# EAGLE design RHD2000_cable_adapt2 (EAGLE 6.2)
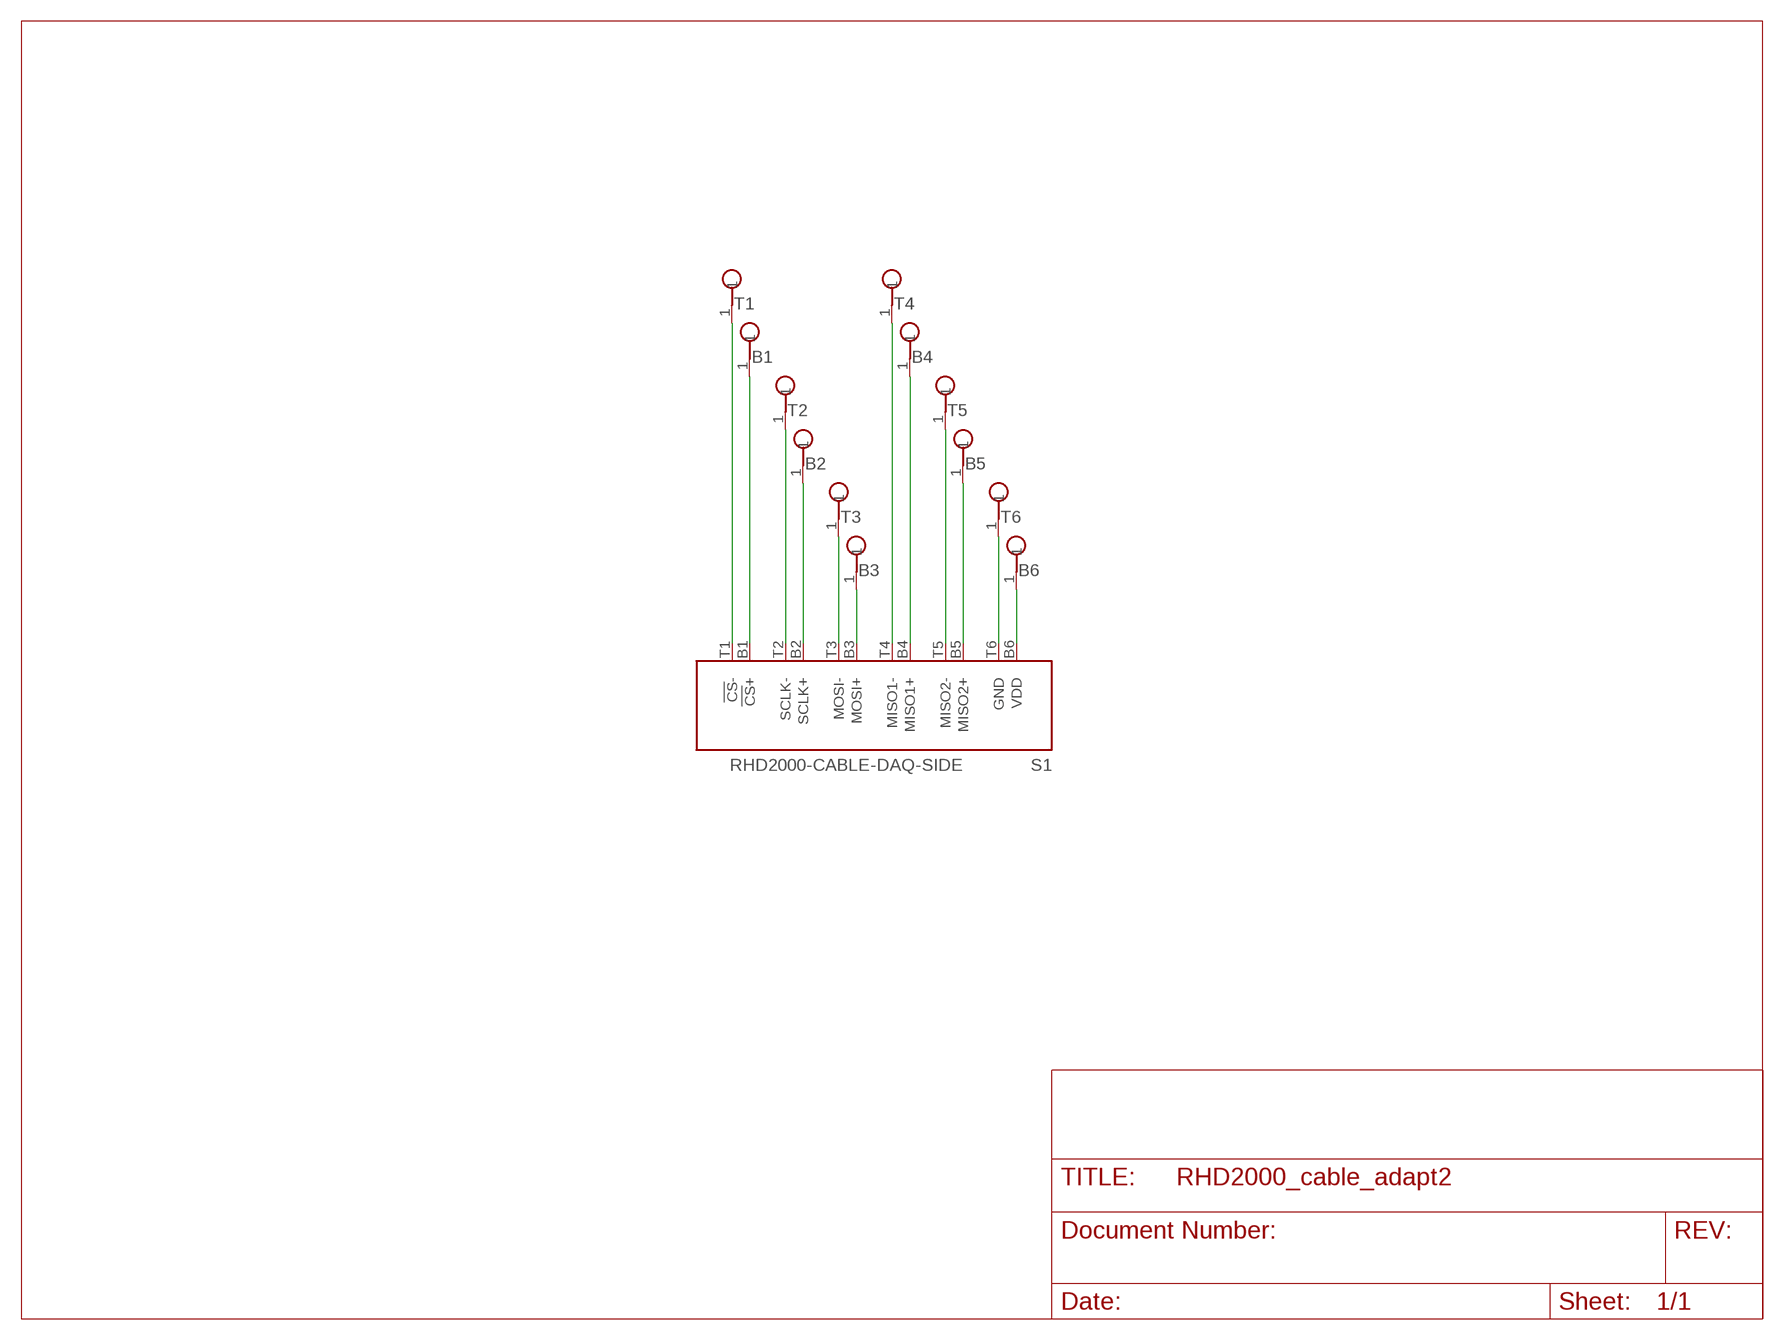
[diagram p0: schematic, sheet 1]

## Parts
B1  TESTPOINT  [TESTPOINT]
B2  TESTPOINT  [TESTPOINT]
B3  TESTPOINT  [TESTPOINT]
B4  TESTPOINT  [TESTPOINT]
B5  TESTPOINT  [TESTPOINT]
B6  TESTPOINT  [TESTPOINT]
S1  RHD2000-CABLE-DAQ-SIDE  [OMNETICS_PZN-12-AA]
T1  TESTPOINT  [TESTPOINT]
T2  TESTPOINT  [TESTPOINT]
T3  TESTPOINT  [TESTPOINT]
T4  TESTPOINT  [TESTPOINT]
T5  TESTPOINT  [TESTPOINT]
T6  TESTPOINT  [TESTPOINT]

## Nets
N$1: S1.T1(!CS!-) T1.1
N$2: B1.1 S1.B1(!CS!+)
N$3: S1.T2(SCLK-) T2.1
N$4: B2.1 S1.B2(SCLK+)
N$5: S1.T3(MOSI-) T3.1
N$6: B3.1 S1.B3(MOSI+)
N$7: S1.T4(MISO1-) T4.1
N$8: B4.1 S1.B4(MISO1+)
N$9: S1.T5(MISO2-) T5.1
N$10: B5.1 S1.B5(MISO2+)
N$11 [power]: S1.T6(GND) T6.1
N$12 [power]: B6.1 S1.B6(VDD)

## Library data of the parts
B1-B6 T1-T6 = RHD2000_eval_board:TESTPOINT: PCB Test Point
S1 = RHD2000_eval_board:RHD2000-CABLE-DAQ-SIDE: Omnetics PZN-12-AA RHD2000 socket - DAQ side

## Net classes
1 thick: width 1.016 mm
2 power: width 0.254 mm

## Board
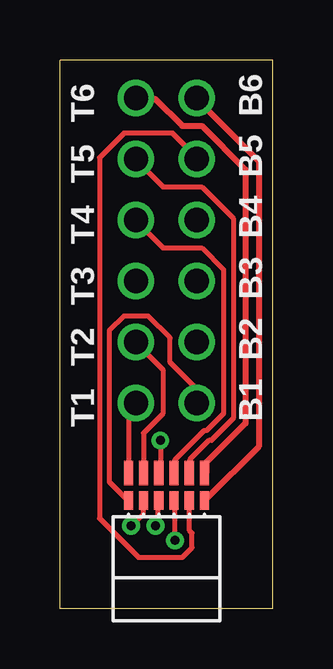
[diagram p1: board, top side]
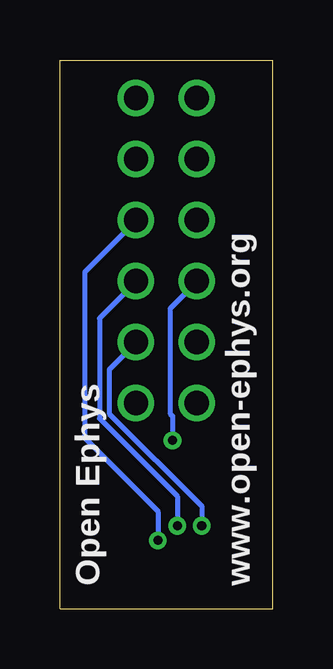
[diagram p2: board, bottom side, seen from below]

Size 8.89 x 22.86 mm. Coordinates in mm from the lower left corner, seen from the top.
Outline: 0,0 0,22.86 8.89,22.86 8.89,0 0,0
Copper layers (1*16): Top 0.0356mm / dielectric 1.5011mm / Bottom 0.0356mm
Design rules "ohs-park-2-layer": minimum track width 6mil, minimum drill 13mil, track to track 6mil, track to pad 6mil, pad to pad 6mil, via to via 6mil, smd to smd 6mil, copper to edge 15mil, drill to drill 6mil, minimum pad ring 7mil, minimum via ring 7mil, stop-mask expansion 4mil, vias tented up to drill 100mil, thermal gap 10mil

### Footprints (pad centres in the part's own frame; a part is rotated, then mirrored left to right if it is on the bottom)
TESTPOINT = drill 1.016: 1 0,0
OMNETICS_PZN-12-AA = smd 0.381 x 0.762: B1 1.587,-1.016; B2 0.953,-1.016; B3 0.318,-1.016; B4 -0.318,-1.016; B5 -0.953,-1.016; B6 -1.587,-1.016 | smd 0.381 x 1.016: T1 1.587,-2.159; T2 0.953,-2.159; T3 0.318,-2.159; T4 -0.318,-2.159; T5 -0.953,-2.159; T6 -1.587,-2.159

### Placement (x,y rotation side)
B1  5.71,8.57 270 top
B2  5.71,11.11 270 top
B3  5.71,13.65 270 top
B4  5.71,16.19 270 top
B5  5.71,18.73 270 top
B6  5.71,21.27 270 top
S1  4.45,3.49 180 top
T1  3.17,8.57 90 top
T2  3.17,11.11 90 top
T3  3.17,13.65 90 top
T4  3.17,16.19 90 top
T5  3.17,18.73 90 top
T6  3.17,21.27 90 top

### Tracks (layer width: path | path; a pad name or v marks a point on that pad's centre or on a via)
N$1
  Top 0.203: S1.T1 2.87,5.69 2.87,8.23 3.17,8.53 T1.1
N$2
  Top 0.203: B1.1 5.71,9.14 4.6,10.26 4.6,11.28 3.68,12.19 2.67,12.19 2.06,11.58 2.06,5.28 2.77,4.57 S1.B1
N$3
  Top 0.203: S1.T2 3.48,5.69 3.48,7.32 4.29,8.13 4.29,9.96 3.17,11.07 T2.1
N$4  (via drill 0.38)
  Top 0.203: v2.97,3.45 3.48,3.96 3.48,4.47 S1.B2
  Bottom 0.203: v2.97,3.45 2.97,4.27 6.83,8.13 6.83,9.96 5.71,11.07 B2.1
N$5  (via drill 0.38)
  Top 0.203: v4.19,7.01 4.19,5.69 S1.T3
  Bottom 0.203: v4.19,7.01 4.19,8.03 4.29,8.13 4.29,12.5 3.17,13.61 T3.1
N$6  (via drill 0.38)
  Top 0.203: v3.99,3.45 4.09,3.56 4.09,4.47 S1.B3
  Bottom 0.203: v3.99,3.45 3.99,4.67 7.24,7.92 7.24,12.09 5.71,13.61 B3.1
N$7
  Top 0.203: S1.T4 4.8,5.69 4.8,6.2 6.02,7.42 6.12,7.42 6.83,8.13 6.83,14.12 5.92,15.04 4.29,15.04 3.17,16.15 T4.1
N$8  (via drill 0.38)
  Top 0.203: v4.8,2.85 4.8,4.47 S1.B4
  Bottom 0.203: v4.8,2.85 4.8,4.06 7.85,7.11 7.85,14.02 5.71,16.15 B4.1
N$9
  Top 0.203: S1.T5 5.41,5.69 5.41,6.2 6.22,7.01 6.33,7.01 7.24,7.92 7.24,16.26 5.92,17.58 4.29,17.58 3.17,18.69 T5.1
N$10
  Top 0.203: S1.B5 5.41,4.47 5.41,3.25 5.51,3.15 5.51,2.54 5.11,2.13 3.28,2.13 1.65,3.76 1.65,18.8 2.67,19.81 4.7,19.81 5.71,18.8 B5.1
N$11
  Top 0.254: S1.T6 6.12,5.69 6.12,6.1 7.75,7.72 7.75,18.29 5.92,20.12 5.11,20.12 3.99,21.23 3.17,21.23 T6.1
N$12
  Top 0.254: S1.B6 6.12,4.57 8.3,6.75 8.3,18.65 5.71,21.23 B6.1

### Text on the board
bPlace: www.open-ephys.org | Open Ephys